# EAGLE design attiny85 (EAGLE 9.6.2)
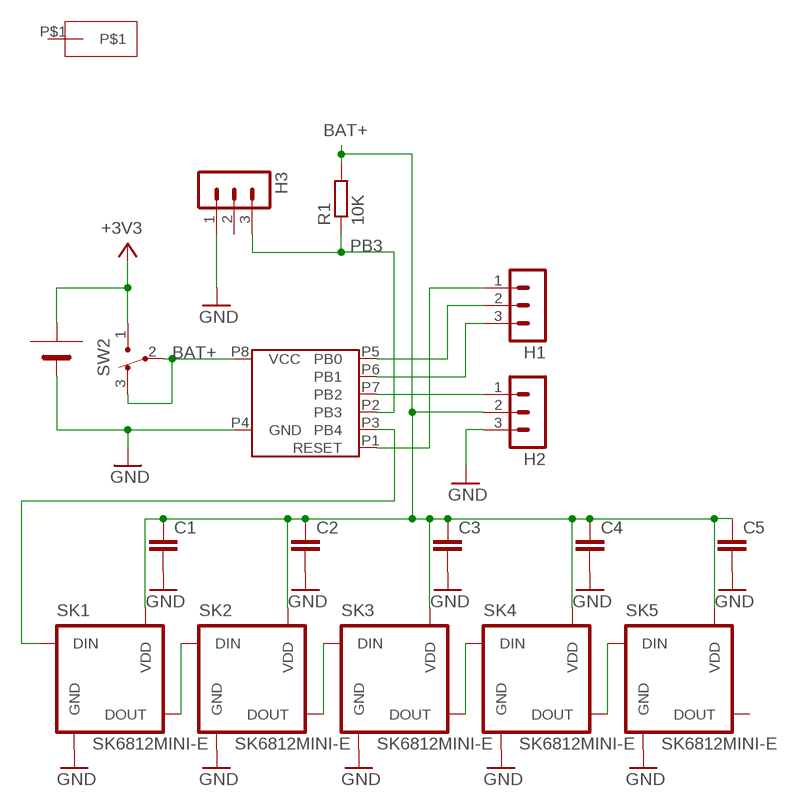
[diagram p0: schematic, sheet 1]

## Parts
ATTINY85-1  ATTINY85  ATTINY85SOP8  [ATTINY85-20SUR]
BAT1  BAT-CR2032  [BAT-CR2032-1]
C1  C-EUC2012  [C2012]
C2  C-EUC2012  [C2012]
C3  C-EUC2012  [C2012]
C4  C-EUC2012  [C2012]
C5  C-EUC2012  [C2012]
H1  PINHEAD-MA03-1SMD  [PINHEAD-MA03-2]
H2  PINHEAD-MA03-1SMD  [PINHEAD-MA03-2]
H3  PINHEAD-MA03-1  [PINHEAD-MA03-1]
PAD33  PAD12X4  [PAD-12X4]
R1  10K  R-EU_M3216  [M3216]
SK1  SK6812MINI-E  [SK6812MINI-E]
SK2  SK6812MINI-E  [SK6812MINI-E]
SK3  SK6812MINI-E  [SK6812MINI-E]
SK4  SK6812MINI-E  [SK6812MINI-E]
SK5  SK6812MINI-E  [SK6812MINI-E]
SW2  POWER  SW3-1  [SW3-1]

## Nets
+3V3: BAT1.BAT+ SW2.1
BAT+: ATTINY85-1.P8(VCC) C1.1 C2.1 C3.1 C4.1 C5.1 H2.2 R1.2 SK1.VDD SK2.VDD SK3.VDD SK4.VDD SK5.VDD SW2.2 SW2.3
GND: ATTINY85-1.P4(GND) BAT1.BAT- C1.2 C2.2 C3.2 C4.2 C5.2 H2.3 H3.1 SK1.GND SK2.GND SK3.GND SK4.GND SK5.GND
N$1: ATTINY85-1.P3(PB4) SK1.DIN
N$2: ATTINY85-1.P7(PB2) H2.1
N$3: ATTINY85-1.P6(PB1) H1.3
N$4: ATTINY85-1.P1(RESET) H1.1
N$5: ATTINY85-1.P5(PB0) H1.2
N$6: SK1.DOUT SK2.DIN
N$7: SK2.DOUT SK3.DIN
N$8: SK3.DOUT SK4.DIN
N$9: SK4.DOUT SK5.DIN
PB3: ATTINY85-1.P2(PB3) H3.3 R1.1
Unconnected: H3.2 PAD33.P$1 SK5.DOUT

## Library data of the parts
ATTINY85-1 = ytani1:ATTINY85
BAT1 = ytani1:BAT-CR2032
C1-C5 = rcl:C-EU: CAPACITOR, European symbol; SPICEPREFIX: C
H1 H2 = ytani1:PINHEAD-MA03-1: PIN HEADER
H3 = ytani1:PINHEAD-MA03-1: PIN HEADER; OC_FARNELL: unknown; OC_NEWARK: unknown
PAD33 = ytani1:PAD
R1 = rcl:R-EU_: RESISTOR, European symbol; SPICEPREFIX: R
SK1-SK5 = ytani1:SK6812MINI-E
SW2 = ytani1:SW3-1: Slide Switch 3x1 pin https://www.amazon.co.jp/gp/product/B01LYVYQNO/ SS12D00G3 2ポジションSPDT 1P2T 3ピン; MF: HiLetgo; URL_AMAZON: https://www.amazon.co.jp/gp/product/B01LYVYQNO/

## Board
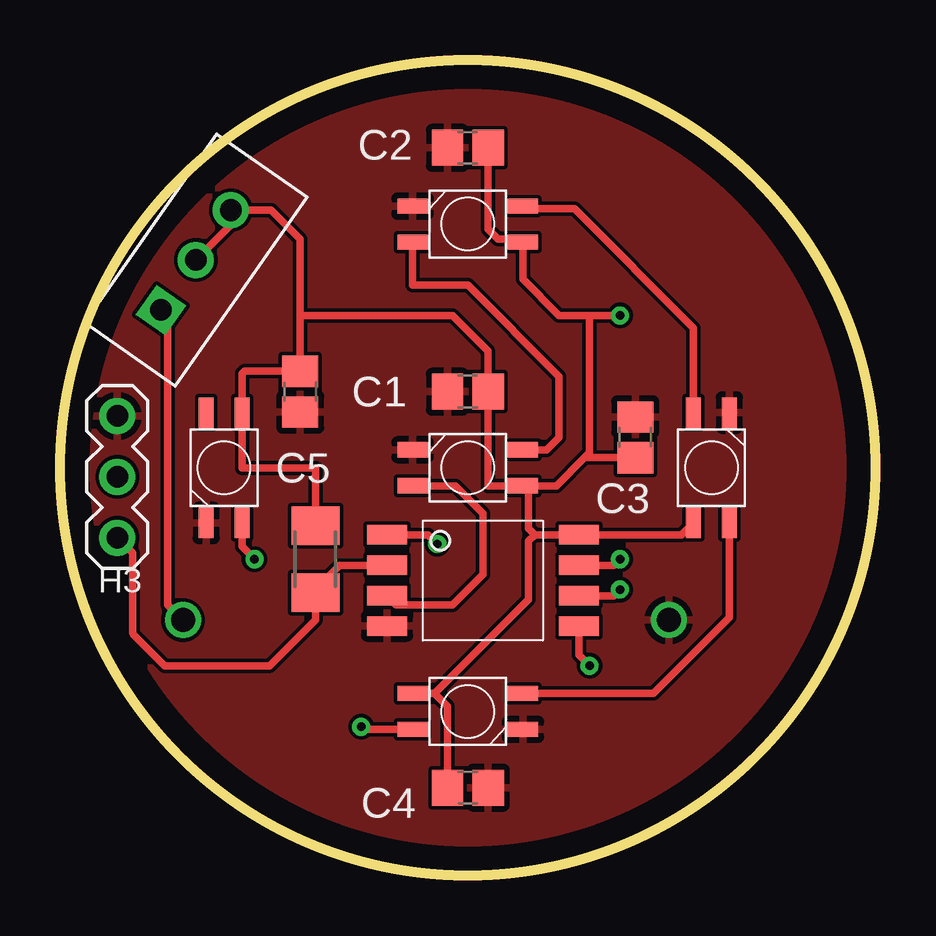
[diagram p1: board, top side]
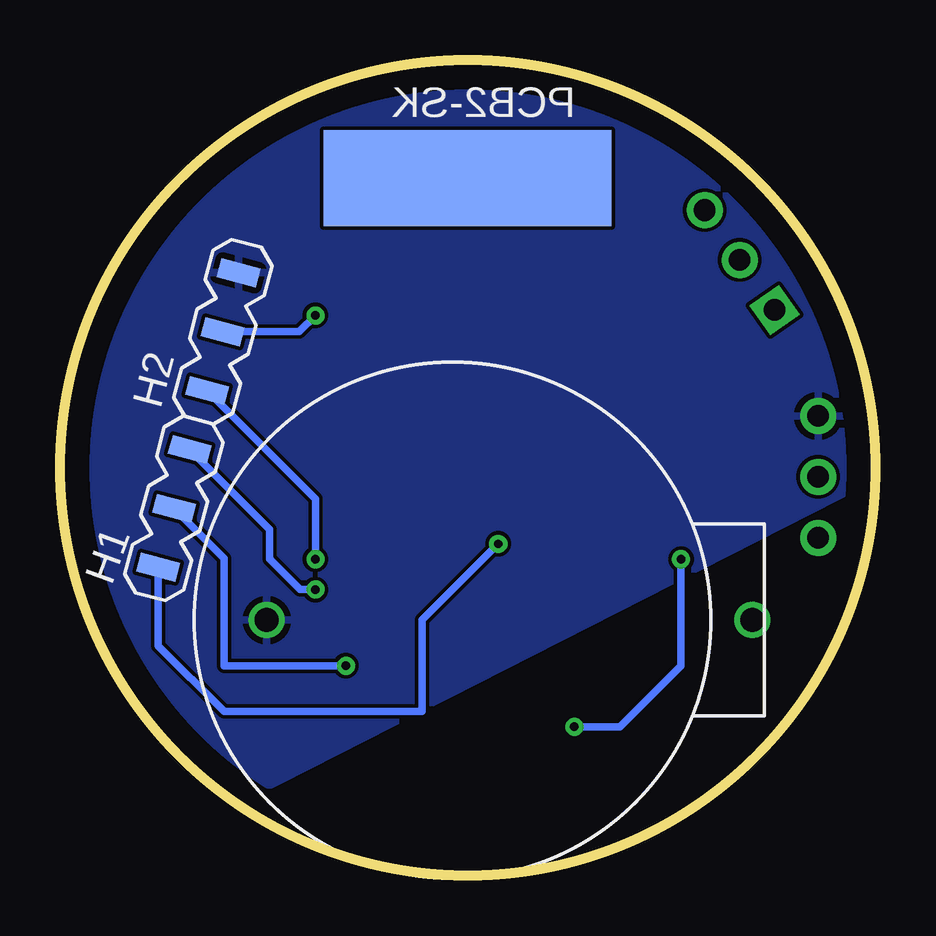
[diagram p2: board, bottom side, seen from below]

Size 34 x 34 mm. Coordinates in mm from the lower left corner, seen from the top.
Outline: circle at 17,17 radius 17
Copper layers (1*16): Top 0.035mm / dielectric 1.5mm / Bottom 0.035mm
Design rules "default": minimum track width 6mil, minimum drill 0.35mm, track to track 6mil, track to pad 6mil, pad to pad 6mil, via to via 6mil, smd to smd 6mil, copper to edge 40mil, drill to drill 6mil, minimum pad ring 10mil, minimum via ring 8mil, stop-mask expansion 4mil, vias tented up to drill 0mil, thermal gap 10mil

### Footprints (pad centres in the part's own frame; a part is rotated, then mirrored left to right if it is on the bottom)
ATTINY85-20SUR = smd 1.676 x 0.813: P1 -4,1.905; P2 -4,0.635; P3 -4,-0.635; P4 -4,-1.905; P5 4,-1.905; P6 4,-0.635; P7 4,0.635; P8 4,1.905
BAT-CR2032-1 = drill 1: BAT+ 0,12.5; BAT- 0,-7.745
C2012 = smd 1.3 x 1.5: 1 -0.85,0; 2 0.85,0
PINHEAD-MA03-2 = smd 0.813 x 1.676: 1 -1.27,0; 2 1.27,0; 3 3.81,0
PINHEAD-MA03-1 = drill 0.9 pad 1.5: 1 -1.27,0; 2 1.27,0; 3 3.81,0
PAD-12X4 = smd 12 x 4: P$1 0,0
M3216 = smd 1.6 x 2: 1 -1.4,0; 2 1.4,0
SK6812MINI-E = smd 1.27 x 0.635: DIN 2.3,0.75; DOUT -2.3,-0.75; GND 2.3,-0.75; VDD -2.3,0.75
SW3-1 = drill 0.9 pad 1.5 square: 1 -1.27,0 | drill 0.9 pad 1.5: 2 1.27,0; 3 3.81,0

### Placement (x,y rotation side)
ATTINY85-1  17.63,12.3 0 top
BAT1  17.63,10.65 270 bottom
C1  17,20.18 180 top
C2  17,30.34 180 top
C3  23.98,18.27 90 top
C4  17,3.67 0 top
C5  10.01,20.18 270 top
H1  29.57,14.08 75 bottom
H2  27.54,21.45 75 bottom
H3  2.39,17.89 270 top
PAD33  17,29.06 0 bottom
R1  10.65,13.19 90 top
SK1  17,17 180 top
SK2  17,27.16 180 top
SK3  27.16,17 90 top
SK4  17,6.84 0 top
SK5  6.84,17 270 top
SW2  4.93,24.62 55 top

### Tracks (layer width: path | path; a pad name or v marks a point on that pad's centre or on a via)
+3V3
  Top 0.305: BAT1.BAT+ 4.5,11.29 4.5,23.29 SW2.1
BAT+  (via drill 0.35)
  Top 0.254: 19.18,26.52 SK2.VDD
  Top 0.305: C3.1 21.86,17.42 | 19.54,16.25 20.7,16.25 21.86,17.42 | 19.54,16.25 SK1.VDD 17.85,16.25 C1.1 17.85,21.86 16.36,23.35 10.01,23.35 | 19.79,14.21 ATTINY85-1.P8 25.92,14.21 SK3.VDD | 19.79,14.21 19.54,14.46 19.54,16.25 | 19.18,26.52 18.27,26.52 17.85,26.95 C2.1 | SK2.VDD 19.3,24.86 20.81,23.35 22.08,23.35 | 10.01,23.35 C5.1 7.69,21.02 7.59,20.93 SK5.VDD 7.59,17 10.65,17 R1.2 | C4.1 16.15,7.05 15.61,7.59 | SK4.VDD 15.61,7.59 | 15.61,7.59 19.54,11.52 19.54,13.95 19.79,14.21 | v23.35,23.35 22.08,23.35 | 21.86,17.42 22.08,17.63 22.08,23.35 | 10.01,23.35 10.01,26.52 8.8,27.74 SW2.3 7.12,27.12 SW2.2
  Bottom 0.305: H2.2 24.03,22.67 v23.35,23.35
GND
  pour Top: -0.15,34.78 34.78,34.78 34.78,-0.15 -0.15,-0.15
  pour Bottom: -0.78,34.15 34.14,34.15 34.14,-0.78 -0.78,17 -0.78,34.15
N$1
  Top 0.305: ATTINY85-1.P3 14.02,11.29 16.36,11.29 17.63,12.55 17.63,15.09 16.48,16.25 SK1.DIN
N$2  (via drill 0.35)
  Top 0.305: ATTINY85-1.P7 23.1,12.94 v23.35,13.19
  Bottom 0.305: H2.1 23.35,15.7 v23.35,13.19
N$3  (via drill 0.35)
  Top 0.305: ATTINY85-1.P6 23.1,11.67 v23.35,11.92
  Bottom 0.305: H1.3 25.25,14.43 25.25,13.19 23.98,11.92 v23.35,11.92
N$4  (via drill 0.35)
  Top 0.305: ATTINY85-1.P1 15.35,14.21 v15.73,13.82
  Bottom 0.305: v15.73,13.82 18.9,10.65 18.9,6.84 27.16,6.84 29.9,9.58 H1.1
N$5  (via drill 0.35)
  Top 0.305: ATTINY85-1.P5 21.63,9.19 v22.08,8.74
  Bottom 0.305: H1.2 27.16,13.22 27.16,8.74 v22.08,8.74
N$6
  Top 0.305: SK1.DOUT 20.29,17.75 20.81,18.27 20.81,20.81 17,24.62 14.7,24.62 SK2.DIN
N$7
  Top 0.305: SK2.DOUT 19.41,27.79 21.45,27.79 26.41,22.83 SK3.DIN
N$8
  Top 0.254: 19.43,7.59 SK4.DIN
  Top 0.305: SK3.DOUT 27.91,10.77 24.73,7.59 19.43,7.59
N$9  (via drill 0.35)
  Top 0.305: SK4.DOUT 12.67,6.09 v12.55,6.21 | SK5.DIN 7.59,13.71 v8.11,13.19
  Bottom 0.305: v8.11,13.19 8.11,8.74 10.65,6.21 v12.55,6.21
PB3
  Top 0.305: ATTINY85-1.P2 11.67,12.94 10.65,11.92 R1.1 10.65,10.65 8.74,8.74 4.36,8.74 3.07,10.03 3.03,10.12 3.03,13.44 H3.3

### Text on the board
bPlace: PCB2-SK